# EAGLE design SerialSnifferDIN (EAGLE 9.6.2)
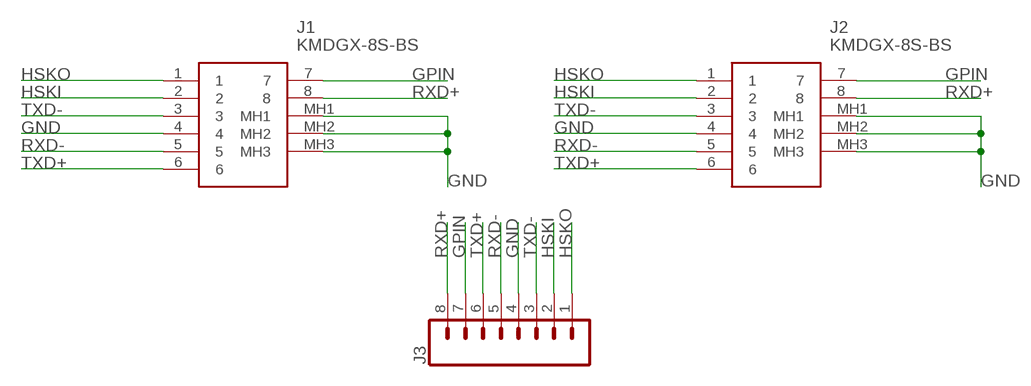
[diagram p0: schematic, sheet 1]

## Parts
J1  KMDGX-8S-BS  [KMDGX8SBS]
J2  KMDGX-8S-BS  [KMDGX8SBS]
J3  CONN_08LOCK_LONGPADS  [1X08_LOCK_LONGPADS]

## Nets
GND: J1.4 J1.MH1 J1.MH2 J1.MH3 J2.4 J2.MH1 J2.MH2 J2.MH3 J3.4
GPIN: J1.7 J2.7 J3.7
HSKI: J1.2 J2.2 J3.2
HSKO: J1.1 J2.1 J3.1
RXD+: J1.8 J2.8 J3.8
RXD-: J1.5 J2.5 J3.5
TXD+: J1.6 J2.6 J3.6
TXD-: J1.3 J2.3 J3.3

## Library data of the parts
J1 J2 = SamacSys_Parts:KMDGX-8S-BS: Circular DIN Connectors 8P R/A FULL SHIELD GOLD PLATED Source: Datasheet <https://componentsearchengine.com/Datasheets/1/KMDGX-8S-BS.pdf>; DESCRIPTION: Circular DIN Connectors 8P R/A FULL SHIELD GOLD PLATED; HEIGHT: 13.3mm; MANUFACTURER_NAME: Kycon; MANUFACTURER_PART_NUMBER: KMDGX-8S-BS; MOUSER_PART_NUMBER: 806-KMDGX-8S-BS; MOUSER_PRICE-STOCK: https://www.mouser.co.uk/ProductDetail/Kycon/KMDGX-8S-BS?qs=cuz0Kzc%2FkGBSI5WmI9vUiw%3D%3D
J3 = SparkFun-Connectors:CONN_08: Multi connection point. Often used as Generic Header-pin footprint for 0.1 inch spaced/style header connections On any of the 0.1 inch spaced packages, you can populate with these: Break Away Headers - Straight <https://www.sparkfun.com/products/116> (PRT-00116) Break Away Male Headers - Right Angle <https://www.sparkfun.com/products/553> (PRT-00553) Female Headers <https://www.sparkfun.com/products/115> (PRT-00115) Break Away Headers - Machine Pin <https://www.sparkfun.com/products/117> (PRT-00117) Break Away Female Headers - Swiss Machine Pin <https://www.sparkfun.com/products/743> (PRT-00743) Arduino Stackable Header - 8 Pin <https://www.sparkfun.com/products/9279> (PRT-09279) For SCREWTERMINALS and SPRING TERMINALS visit here: Screw Terimnals on SparkFun.com <https://www.sparkfun.com/search/results?term=Screw+Terminals> (5mm/3.5mm/2.54mm spacing) This device is also useful as a general connection point to wire up your design to another part of your project. Our various solder wires solder well into these plated through hole pads. Hook-Up Wire - Assortment (Stranded, 22 AWG) <https://www.sparkfun.com/products/11375> (PRT-11375) Hook-Up Wire - Assortment (Solid Core, 22 AWG) <https://www.sparkfun.com/products/11367> (PRT-11367) View the entire wire category on our website here <https://www.sparkfun.com/categories/141> Special notes: Molex polarized connector foot print use with SKU : PRT-08231 with associated crimp pins and housings. 1MM SMD Version SKU: PRT-10208 NOTES ON THE VARIANTS LOCK and LOCK_LONGPADS... This footprint was designed to help hold the alignment of a through-hole component (i.e. 6-pin header) while soldering it into place. You may notice that each hole has been shifted either up or down by 0.005 of an inch from it's more standard position (which is a perfectly straight line). This slight alteration caused the pins (the squares in the middle) to touch the edges of the holes. Because they are alternating, it causes a "brace" to hold the component in place. 0.005 has proven to be the perfect amount of "off-center" position when using our standard breakaway headers. Although looks a little odd when you look at the bare footprint, once you have a header in there, the alteration is very hard to notice. Also,if you push a header all the way into place, it is covered up entirely on the bottom side.

## Board
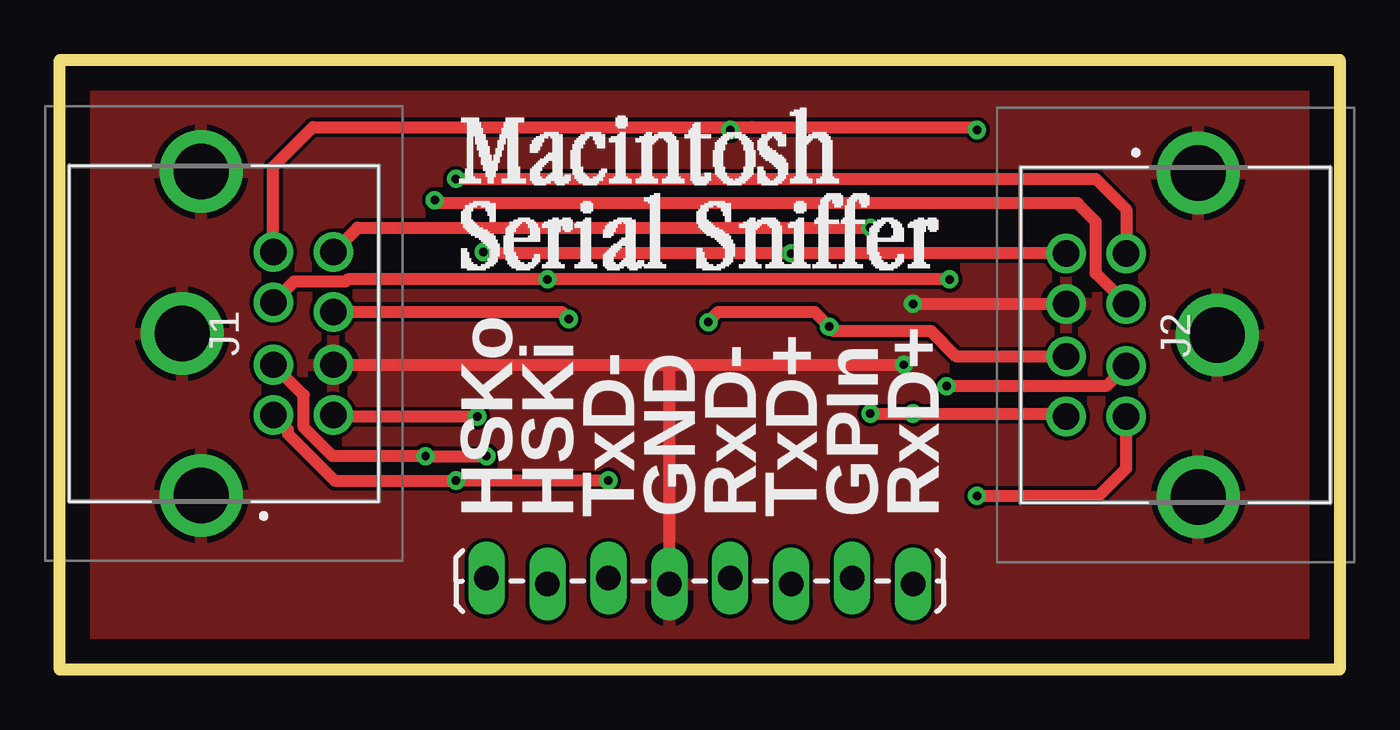
[diagram p1: board, top side]
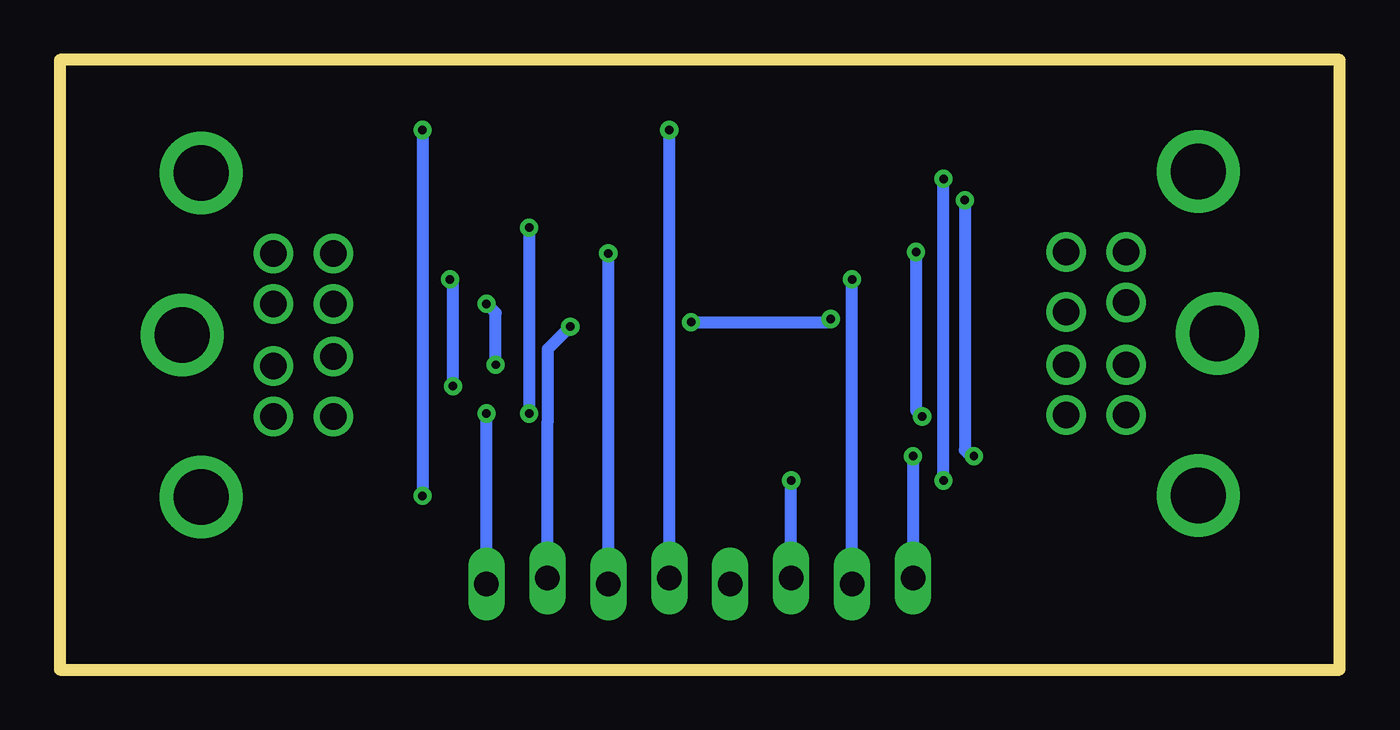
[diagram p2: board, bottom side, seen from below]

Size 53.34 x 25.4 mm. Coordinates in mm from the lower left corner, seen from the top.
Outline: 0,25.4 53.34,25.4 53.34,0 0,0 0,25.4
Copper layers (1*16): Top 0.035mm / dielectric 1.5mm / Bottom 0.035mm
Design rules "default *": minimum track width 6mil, minimum drill 0.35mm, track to track 6mil, track to pad 6mil, pad to pad 6mil, via to via 6mil, smd to smd 6mil, copper to edge 40mil, drill to drill 12mil, minimum pad ring 10mil, minimum via ring 8mil, stop-mask expansion 4mil, vias tented up to drill 30mil, thermal gap 10mil
tKeepout: area 2.5,-1.3 to 7.5,16.5; area 12.6,-10.2 to 40.6,-3.8; area 45.6,-3.8 to 55.8,17.8
bKeepout: area 45.6,-3.8 to 55.8,17.8; area 12.6,-10.2 to 40.6,-3.8; area 2.5,-1.3 to 7.5,16.5

### Footprints (pad centres in the part's own frame; a part is rotated, then mirrored left to right if it is on the bottom)
KMDGX8SBS = drill 1.1 pad 1.65: 1 0,0; 2 2.6,0; 3 -2.1,0; 4 0,-2.5; 5 4.7,0; 6 -2.1,-2.5; 7 2.2,-2.5; 8 4.7,-2.5 | drill 2.3 pad 3.45: MH1 -5.45,3; MH2 1.3,3.8; MH3 8.05,3
1X08_LOCK_LONGPADS = drill 1.016 long: 1 0,0.127; 2 2.54,-0.127; 3 5.08,0.127; 4 7.62,-0.127; 5 10.16,0.127; 6 12.7,-0.127; 7 15.24,0.127; 8 17.78,-0.127

### Placement (x,y rotation side)
J1  8.89,12.7 90 top
J2  44.45,15.24 270 top
J3  17.78,3.68 0 top

### Tracks (layer width: path | path; a pad name or v marks a point on that pad's centre or on a via)
GND  (via drill 0.35)
  Top 0.508: J1.4 25.4,12.7 | 25.4,12.7 v35.18,12.7 | v35.56,15.24 J2.4 | J3.4 25.4,12.7
  Bottom 0.508: v35.18,12.7 35.18,14.86 v35.56,15.24
  pour Top: 0,25.4 53.34,25.4 53.34,0 0,0
GPIN  (via drill 0.35)
  Top 0.508: J2.7 37.38,13.04 36.32,14.1 32.26,14.1 v32.07,14.29 31.46,14.9 27.45,14.9 v27.03,14.48 | J1.7 20.91,14.9 v21.21,14.6
  Bottom 0.508: J3.7 33.02,10.32 33,10.34 33,13.36 v32.07,14.29 | v21.21,14.6 21.34,14.48 v27.03,14.48
HSKI  (via drill 0.35)
  Top 0.508: v36.96,11.81 41.44,11.81 43.62,11.81 J2.2 | v37.08,16.26 v20.32,16.26 11.99,16.26 11.9,16.17 9.76,16.17 J1.2
  Bottom 0.508: v36.96,11.81 36.96,16.13 v37.08,16.26 | J3.2 v20.32,16.26
HSKO  (via drill 0.35)
  Top 0.508: J2.1 43.18,16.51 43.18,17.85 43.18,18.67 42.42,19.43 15.75,19.43 v15.62,19.56 | J1.1 10.16,11.43 10.16,10.09 11.36,8.89 v15.24,8.89 v17.78,8.89
  Bottom 0.508: v15.62,19.56 15.62,9.14 15.37,8.89 v15.24,8.89 | v17.78,8.89 J3.1
RXD+  (via drill 0.35)
  Top 0.508: J1.8 12.41,18.41 v33.78,18.41 | v33.78,10.67 v35.56,10.67 41.82,10.67 J2.8
  Bottom 0.508: v33.78,18.41 v33.78,10.67 | J3.8 v35.56,10.67
RXD-  (via drill 0.35)
  Top 0.508: J1.5 8.89,20.95 10.54,22.61 28.83,22.61 | 28.83,22.61 38.1,22.61 v38.23,22.48 | v38.23,7.24 43.31,7.24 44.45,8.38 J2.5 | v27.94,22.48 28.06,22.61 28.83,22.61
  Bottom 0.508: v38.23,22.48 v38.23,7.24 | J3.5 v27.94,22.48
TXD+  (via drill 0.35)
  Top 0.508: J2.6 v30.48,17.34 17.71,17.34 v17.65,17.4 | v17.4,10.54 11.45,10.54 J1.6
  Bottom 0.508: v17.65,17.4 17.65,10.79 v17.4,10.54 | J3.6 v30.48,17.34
TXD-  (via drill 0.35)
  Top 0.508: J1.3 9.5,9.99 9.5,9.82 11.44,7.87 v16.51,7.87 v22.86,7.87 | v16.51,20.45 43.18,20.45 44.45,19.18 J2.3
  Bottom 0.508: v16.51,7.87 v16.51,20.45 | J3.3 v22.86,7.87

### Text on the board
tPlace: HSKo | HSKi | TxD- | GND | RxD- | TxD+ | GPIn | RxD+